# EAGLE design main (EAGLE 9.6.2)
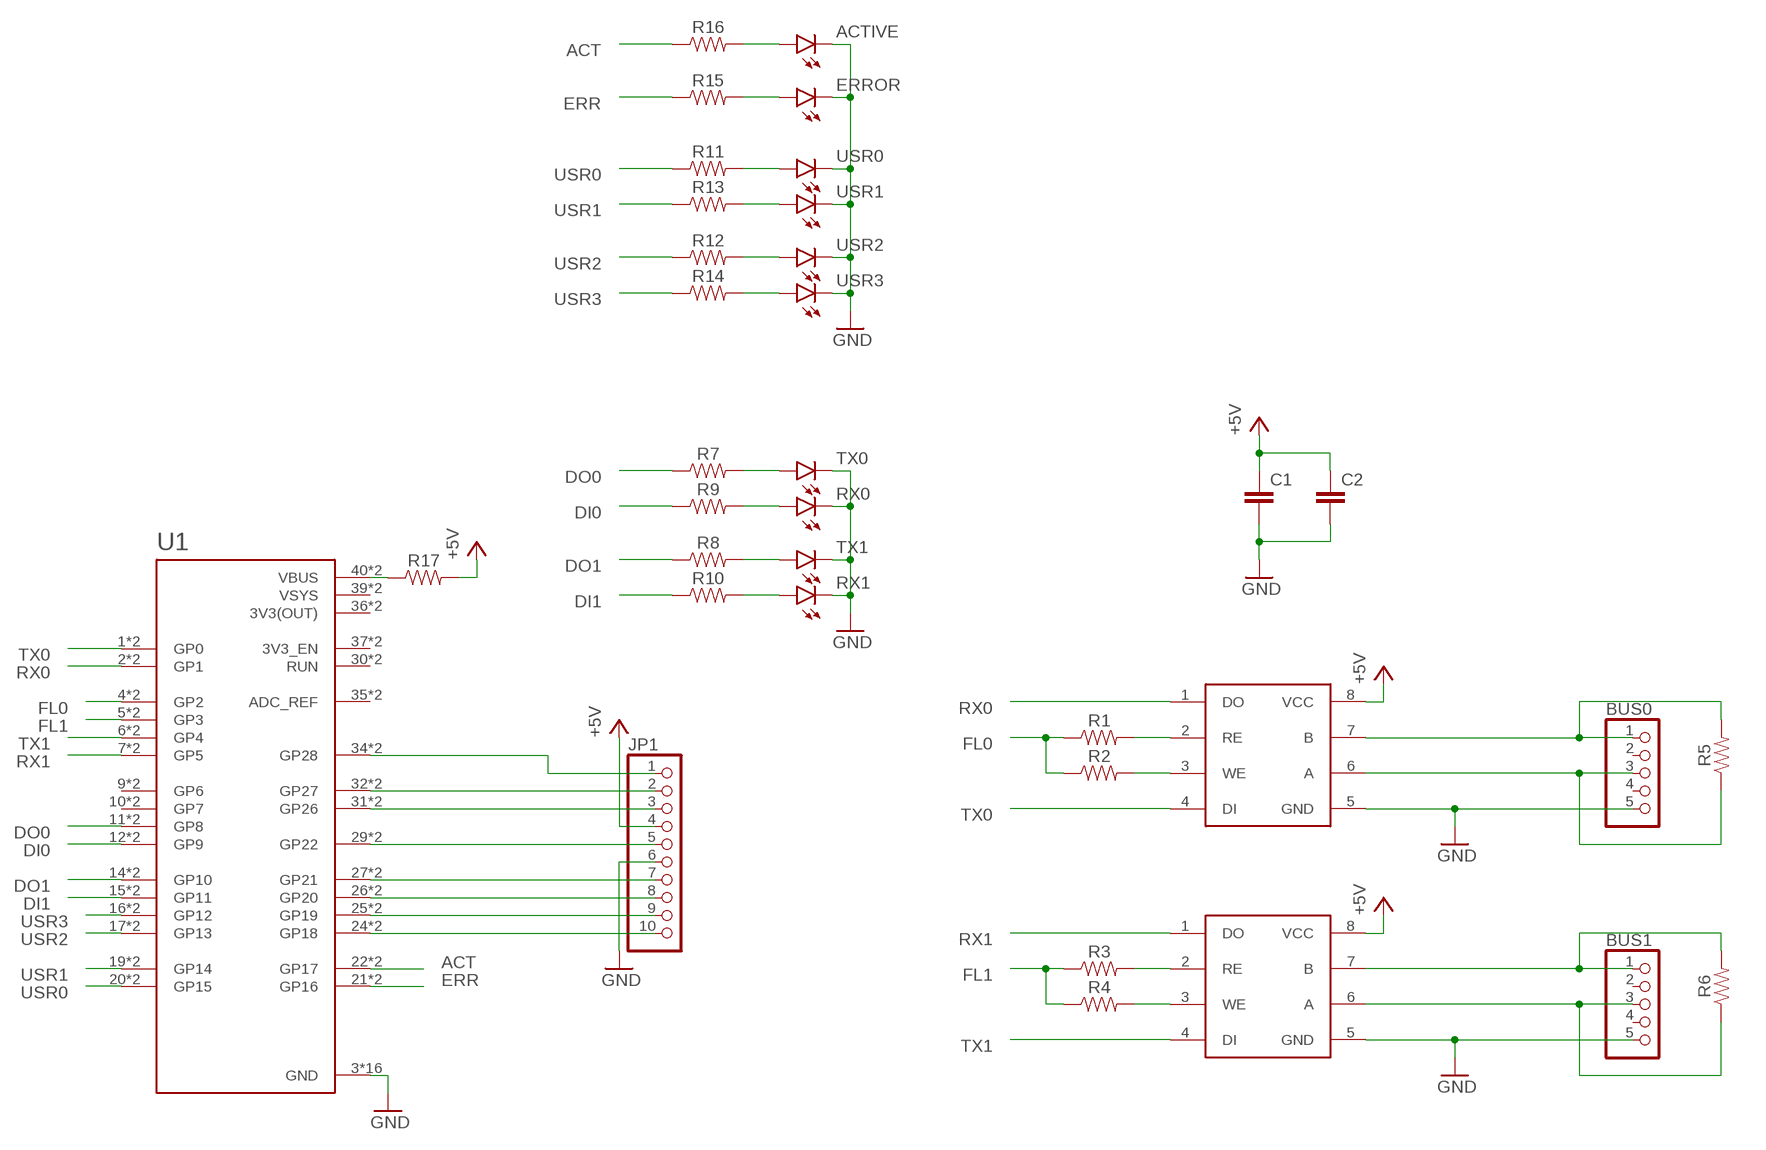
[diagram p0: schematic, sheet 1]

## Parts
ACTIVE  LED0603  [LED-0603]
BUS0  PINHD-1X5  [1X05]
BUS1  PINHD-1X5  [1X05]
C1  CAP-0603  [0603]
C2  CAP-0603  [0603]
ERROR  LED0603  [LED-0603]
JP1  PINHD-1X10  [1X10]
R1  RESISTOR0603  [0603]
R2  RESISTOR0603  [0603]
R3  RESISTOR0603  [0603]
R4  RESISTOR0603  [0603]
R5  RESISTOR0603  [0603]
R6  RESISTOR0603  [0603]
R7  RESISTOR0603  [0603]
R8  RESISTOR0603  [0603]
R9  RESISTOR0603  [0603]
R10  RESISTOR0603  [0603]
R11  RESISTOR0603  [0603]
R12  RESISTOR0603  [0603]
R13  RESISTOR0603  [0603]
R14  RESISTOR0603  [0603]
R15  RESISTOR0603  [0603]
R16  RESISTOR0603  [0603]
R17  RESISTOR0603  [0603]
RX0  LED0603  [LED-0603]
RX1  LED0603  [LED-0603]
TX0  LED0603  [LED-0603]
TX1  LED0603  [LED-0603]
U1  RASPBERRY_PICO-NO_DEBUG  [PICO-PKG-NO_DEBUG]
U$1  MAX485  [SO8]
U$2  MAX485  [SO8]
USR0  LED0603  [LED-0603]
USR1  LED0603  [LED-0603]
USR2  LED0603  [LED-0603]
USR3  LED0603  [LED-0603]

## Nets
+5V: C1.1 C2.1 JP1.4 R17.2 U$1.8(VCC) U$2.8(VCC)
ACT: R16.1 U1.22(GP17) U1.P$22(GP17)
DI0: R9.1 U1.12(GP9) U1.P$12(GP9)
DI1: R10.1 U1.15(GP11) U1.P$15(GP11)
DO0: R7.1 U1.11(GP8) U1.P$11(GP8)
DO1: R8.1 U1.14(GP10) U1.P$14(GP10)
ERR: R15.1 U1.21(GP16) U1.P$21(GP16)
FL0: R1.1 R2.1 U1.4(GP2) U1.P$4(GP2)
FL1: R3.1 R4.1 U1.5(GP3) U1.P$5(GP3)
GND: ACTIVE.C BUS0.5 BUS1.5 C1.2 C2.2 ERROR.C JP1.6 RX0.C RX1.C TX0.C TX1.C U1.3(GND) U1.8(GND) U1.13(GND) U1.18(GND) U1.23(GND) U1.28(GND) U1.33(GND) U1.38(GND) U1.P$3(GND) U1.P$8(GND) U1.P$13(GND) U1.P$18(GND) U1.P$23(GND) U1.P$28(GND) U1.P$33(GND) U1.P$38(GND) U$1.5(GND) U$2.5(GND) USR0.C USR1.C USR2.C USR3.C
N$1: BUS0.1 R5.2 U$1.7(B)
N$2: BUS0.3 R5.1 U$1.6(A)
N$3: BUS1.1 R6.2 U$2.7(B)
N$4: BUS1.3 R6.1 U$2.6(A)
N$5: R1.2 U$1.2(RE)
N$6: R2.2 U$1.3(WE)
N$7: R3.2 U$2.2(RE)
N$8: R4.2 U$2.3(WE)
N$9: R11.2 USR0.A
N$10: R7.2 TX0.A
N$11: R9.2 RX0.A
N$12: R8.2 TX1.A
N$13: R10.2 RX1.A
N$14: R13.2 USR1.A
N$15: R12.2 USR2.A
N$16: R14.2 USR3.A
N$17: ERROR.A R15.2
N$18: ACTIVE.A R16.2
N$19: JP1.10 U1.24(GP18) U1.P$24(GP18)
N$20: JP1.9 U1.25(GP19) U1.P$25(GP19)
N$21: JP1.8 U1.26(GP20) U1.P$26(GP20)
N$22: JP1.7 U1.27(GP21) U1.P$27(GP21)
N$23: JP1.5 U1.29(GP22) U1.P$29(GP22)
N$24: JP1.3 U1.31(GP26) U1.P$31(GP26)
N$25: JP1.2 U1.32(GP27) U1.P$32(GP27)
N$26: JP1.1 U1.34(GP28) U1.P$34(GP28)
N$27: R17.1 U1.40(VBUS) U1.P$40(VBUS)
RX0: U1.2(GP1) U1.P$2(GP1) U$1.1(DO)
RX1: U1.7(GP5) U1.P$7(GP5) U$2.1(DO)
TX0: U1.1(GP0) U1.P$1(GP0) U$1.4(DI)
TX1: U1.6(GP4) U1.P$6(GP4) U$2.4(DI)
USR0: R11.1 U1.20(GP15) U1.P$20(GP15)
USR1: R13.1 U1.19(GP14) U1.P$19(GP14)
USR2: R12.1 U1.17(GP13) U1.P$17(GP13)
USR3: R14.1 U1.16(GP12) U1.P$16(GP12)
Unconnected: BUS0.2 BUS0.4 BUS1.2 BUS1.4 U1.9(GP6) U1.10(GP7) U1.30(RUN) U1.35(ADC_REF) U1.37(3V3_EN) U1.P$9(GP6) U1.P$10(GP7) U1.P$30(RUN) U1.P$35(ADC_REF) U1.P$37(3V3_EN)

## Power pins joined to a net without a drawn wire
3V3(OUT): U1.36(3V3(OUT)) U1.P$36(3V3(OUT))
VSYS: U1.39(VSYS) U1.P$39(VSYS)

## Library data of the parts
ACTIVE ERROR RX0 RX1 TX0 TX1 USR0 USR1-USR3 = SparkFun-LED:LED: LED (Generic) Standard schematic elements and footprints for 5mm, 3mm, 1206, and 0603 sized LEDs. Generic LEDs with no color specified.
BUS0 BUS1 = pinhead:PINHD-1X5: PIN HEADER
C1 C2 = SparkFun-Capacitors:CAP
JP1 = pinhead:PINHD-1X10: PIN HEADER
R1-R17 = SparkFun-Resistors:RESISTOR: Generic Resistor Package
U1 = RpiPico:RASPBERRY_PICO-NO_DEBUG
U$1 U$2 = Max485:MAX485

## Board
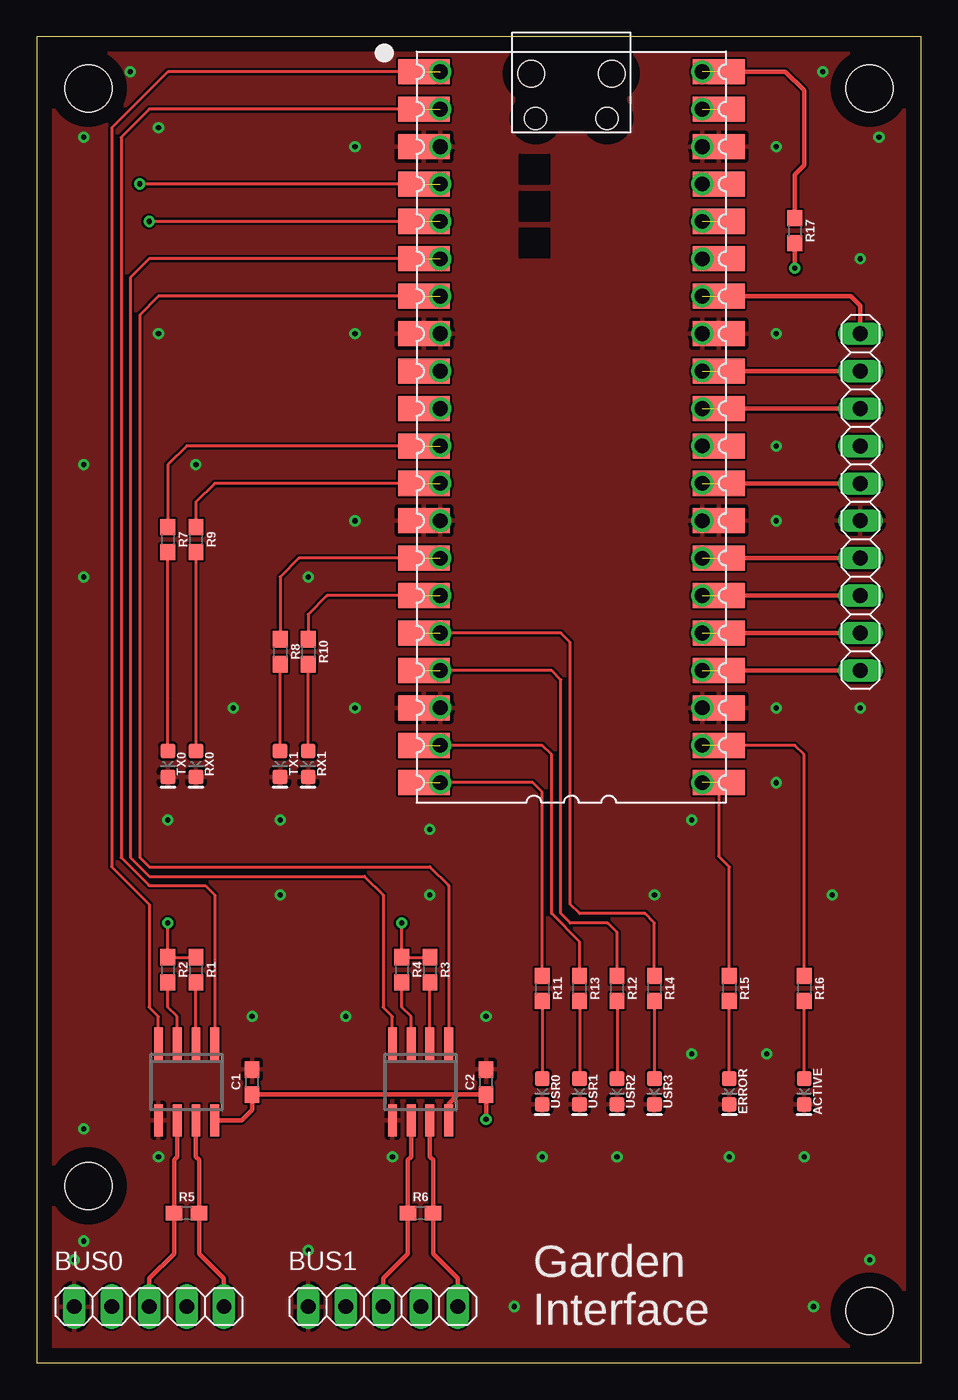
[diagram p1: board, top side]
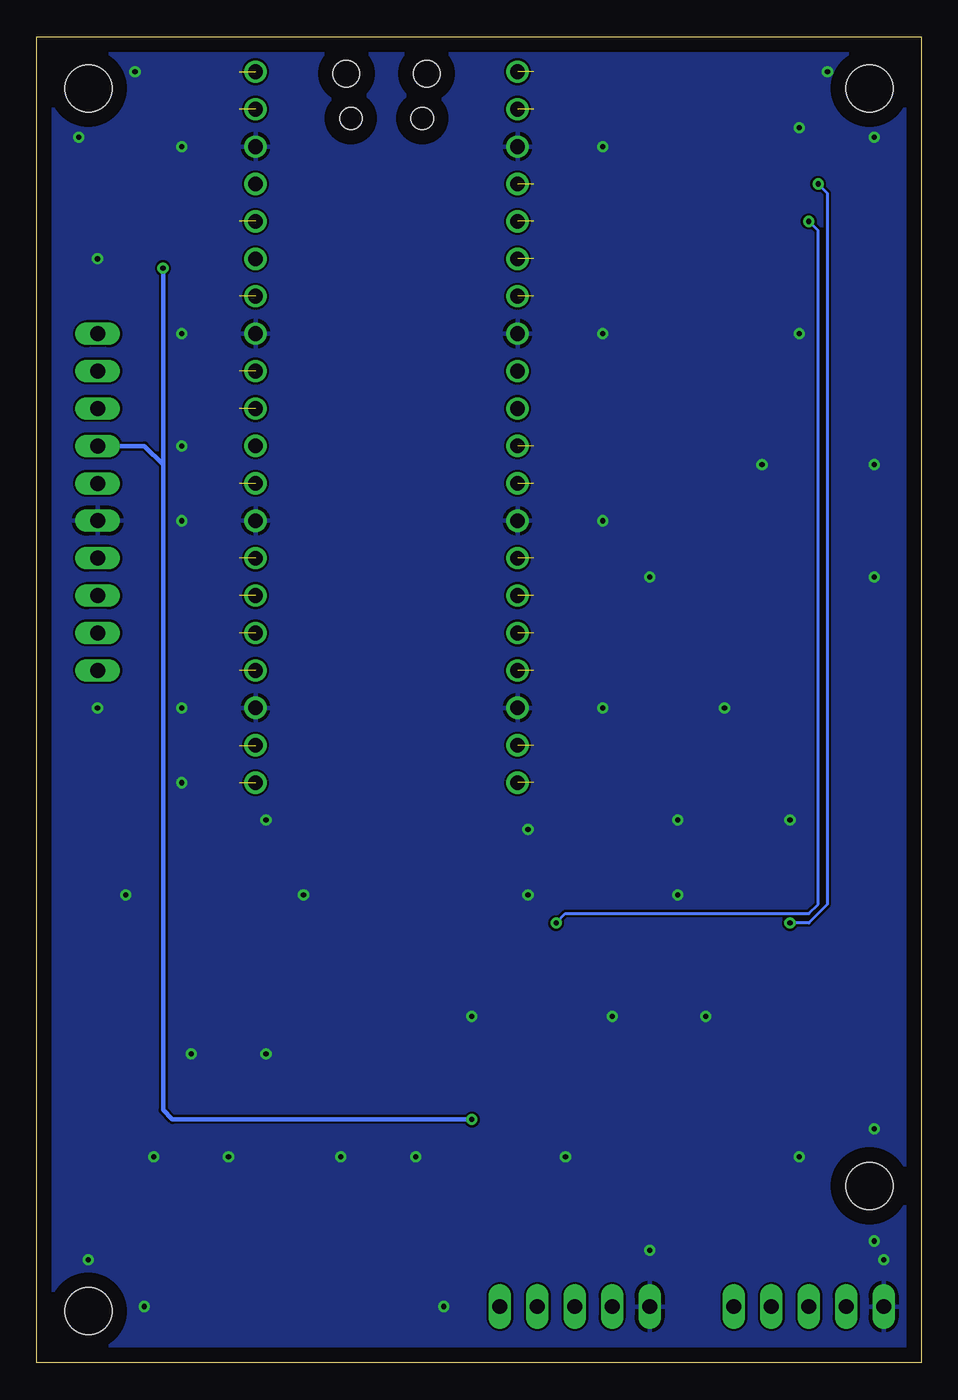
[diagram p2: board, bottom side, seen from below]

Size 60 x 90 mm. Coordinates in mm from the lower left corner, seen from the top.
Outline: 0,0 60,0 60,90 0,90 0,0
Copper layers (1*16): Top 0.035mm / dielectric 1.5mm / Bottom 0.035mm
Design rules "default": minimum track width 6mil, minimum drill 0.35mm, track to track 6mil, track to pad 6mil, pad to pad 6mil, via to via 6mil, smd to smd 6mil, copper to edge 40mil, drill to drill 6mil, minimum pad ring 10mil, minimum via ring 8mil, stop-mask expansion 4mil, vias tented up to drill 0mil, thermal gap 10mil
Holes 3.2 mm at 3.5,86.5 56.5,86.5 56.5,3.5 3.5,12

### Footprints (pad centres in the part's own frame; a part is rotated, then mirrored left to right if it is on the bottom)
LED-0603 = smd 1 x 1: A -0.877,0; C 0.877,0
1X05 = drill 1.016 long: 1 -5.08,0; 2 -2.54,0; 3 0,0; 4 2.54,0; 5 5.08,0
0603 = smd 1.1 x 1: 1 -0.85,0; 2 0.85,0
1X10 = drill 1.016 long: 1 -11.43,0; 2 -8.89,0; 3 -6.35,0; 4 -3.81,0; 5 -1.27,0; 6 1.27,0; 7 3.81,0; 8 6.35,0; 9 8.89,0; 10 11.43,0
PICO-PKG-NO_DEBUG = drill 1: 1 -7.62,25.4; 2 -7.62,22.86; 3 -7.62,20.32; 4 -7.62,17.78; 5 -7.62,15.24; 6 -7.62,12.7; 7 -7.62,10.16; 8 -7.62,7.62; 9 -7.62,5.08; 10 -7.62,2.54; 11 -7.62,0; 12 -7.62,-2.54; 13 -7.62,-5.08; 14 -7.62,-7.62; 15 -7.62,-10.16; 16 -7.62,-12.7; 17 -7.62,-15.24; 18 -7.62,-17.78; 19 -7.62,-20.32; 20 -7.62,-22.86; 21 10.16,-22.86; 22 10.16,-20.32; 23 10.16,-17.78; 24 10.16,-15.24; 25 10.16,-12.7; 26 10.16,-10.16; 27 10.16,-7.62; 28 10.16,-5.08; 29 10.16,-2.54; 30 10.16,0; 31 10.16,2.54; 32 10.16,5.08; 33 10.16,7.62; 34 10.16,10.16; 35 10.16,12.7; 36 10.16,15.24; 37 10.16,17.78; 38 10.16,20.32; 39 10.16,22.86; 40 10.16,25.4 | smd 3.5 x 1.7: P$1 -8.73,25.4; P$2 -8.73,22.86; P$3 -8.73,20.32; P$4 -8.73,17.78; P$5 -8.73,15.24; P$6 -8.73,12.7; P$7 -8.73,10.16; P$8 -8.73,7.62; P$9 -8.73,5.08; P$10 -8.73,2.54; P$11 -8.73,0; P$12 -8.73,-2.54; P$13 -8.73,-5.08; P$14 -8.73,-7.62; P$15 -8.73,-10.16; P$16 -8.73,-12.7; P$17 -8.73,-15.24; P$18 -8.73,-17.78; P$19 -8.73,-20.32; P$20 -8.73,-22.86; P$21 11.27,-22.86; P$22 11.27,-20.32; P$23 11.27,-17.78; P$24 11.27,-15.24; P$25 11.27,-12.7; P$26 11.27,-10.16; P$27 11.27,-7.62; P$28 11.27,-5.08; P$29 11.27,-2.54; P$30 11.27,0; P$31 11.27,2.54; P$32 11.27,5.08; P$33 11.27,7.62; P$34 11.27,10.16; P$35 11.27,12.7; P$36 11.27,15.24; P$37 11.27,17.78; P$38 11.27,20.32; P$39 11.27,22.86; P$40 11.27,25.4 | hole 1.8: -1.455,25.27; 3.995,25.27 | hole 1.5: -1.155,22.24; 3.695,22.24
SO8 = smd 0.6 x 2.2: 1 -1.905,-2.6; 2 -0.635,-2.6; 3 0.635,-2.6; 4 1.905,-2.6; 5 1.905,2.6; 6 0.635,2.6; 7 -0.635,2.6; 8 -1.905,2.6

### Placement (x,y rotation side)
ACTIVE  52.07,18.41 270 top
BUS0  7.62,3.81 180 top
BUS1  23.5,3.81 180 top
C1  14.61,19.05 90 top
C2  30.48,19.05 90 top
ERROR  46.99,18.41 270 top
JP1  55.88,58.42 270 top
R1  10.79,26.67 270 top
R2  8.89,26.67 270 top
R3  26.67,26.67 270 top
R4  24.77,26.67 270 top
R5  10.16,10.16 0 top
R6  26.04,10.16 0 top
R7  8.89,55.88 270 top
R8  16.51,48.26 270 top
R9  10.79,55.88 270 top
R10  18.41,48.26 270 top
R11  34.29,25.4 270 top
R12  39.37,25.4 270 top
R13  36.83,25.4 270 top
R14  41.91,25.4 270 top
R15  46.99,25.4 270 top
R16  52.07,25.4 270 top
R17  51.44,76.83 270 top
RX0  10.79,40.64 270 top
RX1  18.41,40.64 270 top
TX0  8.89,40.64 270 top
TX1  16.51,40.64 270 top
U1  35,62.23 0 top
U$1  10.16,19.05 180 top
U$2  26.04,19.05 180 top
USR0  34.29,18.41 270 top
USR1  36.83,18.41 270 top
USR2  39.37,18.41 270 top
USR3  41.91,18.41 270 top

### Tracks (layer width: path | path; a pad name or v marks a point on that pad's centre or on a via)
3V3(OUT)  (1 unrouted)
+5V  (via drill 0.35)
  Top 0.305: U$1.8 13.91,16.45 14.61,17.14 C1.1 28.57,18.2 | 28.57,18.2 C2.1 v30.48,16.51 | U$2.8 27.94,17.57 28.57,18.2 | R17.2 v51.44,74.3
  Bottom 0.305: JP1.4 52.7,62.23 51.44,60.96 | 51.44,60.96 51.44,17.14 50.8,16.51 v30.48,16.51 | v51.44,74.3 51.44,60.96
ACT  (1 unrouted)
  Top 0.203: R16.1 52.07,41.27 51.44,41.91 U1.P$22
DI0  (1 unrouted)
  Top 0.203: U1.P$12 12.06,59.69 10.79,58.42 R9.1
DI1  (1 unrouted)
  Top 0.203: U1.P$15 19.68,52.07 18.41,50.8 R10.1
DO0  (1 unrouted)
  Top 0.203: U1.P$11 10.16,62.23 8.89,60.96 R7.1
DO1  (1 unrouted)
  Top 0.203: U1.P$14 17.78,54.61 16.51,53.34 R8.1
ERR  (1 unrouted)
  Top 0.203: U1.P$21 46.27,34.38 46.99,33.66 R15.1
FL0  (via drill 0.35)  (1 unrouted)
  Top 0.203: R1.1 R2.1 v8.89,29.84 | U1.P$4 v6.99,80.01
  Bottom 0.203: v6.99,80.01 6.35,79.38 6.35,31.11 7.62,29.84 v8.89,29.84
FL1  (via drill 0.35)  (1 unrouted)
  Top 0.203: R3.1 R4.1 v24.77,29.84 | v7.62,77.47 U1.P$5
  Bottom 0.203: v7.62,77.47 6.99,76.83 6.99,31.11 7.62,30.48 24.13,30.48 v24.77,29.84
GND  (via drill 0.35)
  other vias: 3.17,83.19 6.35,87.63 53.34,87.63 57.15,83.19 56.52,6.99 52.7,3.81 3.17,15.88 3.17,8.26 2.54,6.99 8.26,13.97 24.13,13.97 30.48,23.5 14.61,23.5 26.67,31.75 8.89,36.83 16.51,36.83 10.79,60.96 18.41,53.34 8.26,83.82 3.17,60.96 3.17,53.34 26.67,36.2 44.45,36.83 55.88,44.45 55.88,74.93 34.29,13.97 39.37,13.97 46.99,13.97 52.07,13.97 44.45,20.95 41.91,31.75 49.53,20.95 18.41,7.62 20.95,23.5 16.51,31.75 21.59,69.85 21.59,82.55 21.59,57.15 21.59,44.45 50.16,69.85 50.16,62.23 50.16,57.15 50.16,44.45 50.16,39.37 53.98,31.75 32.38,3.81 50.16,82.55 8.26,69.85 13.34,44.45
  pour Top: -0.64,90.81 60.96,90.81 60.96,-0.64 22.23,-0.64 -0.64,-0.64
  pour Bottom: -1.27,91.44 61.59,91.44 61.59,-1.27 -1.27,-1.27
N$1
  Top 0.305: U$1.7 10.79,13.97 11.01,13.76 R5.2 11.01,7.41 12.7,5.71 BUS0.1
N$2
  Top 0.305: U$1.6 9.53,13.97 9.31,13.76 R5.1 9.31,7.41 7.62,5.71 BUS0.3
N$3
  Top 0.305: U$2.7 26.67,13.97 26.89,13.76 R6.2 26.89,7.41 28.57,5.71 BUS1.1
N$4
  Top 0.305: U$2.6 25.4,13.97 25.18,13.76 R6.1 25.18,7.41 23.5,5.71 BUS1.3
N$5
  Top 0.203: U$1.2 R1.2
N$6
  Top 0.203: U$1.3 9.53,23.5 8.89,24.13 R2.2
N$7
  Top 0.203: U$2.2 R3.2
N$8
  Top 0.203: U$2.3 25.4,23.5 24.77,24.13 R4.2
N$9
  Top 0.203: R11.2 USR0.A
N$10
  Top 0.203: TX0.A 8.89,45.09 | 8.89,45.09 R7.2 | 8.89,45.09
N$11
  Top 0.203: R9.2 RX0.A
N$12
  Top 0.203: TX1.A R8.2
N$13
  Top 0.203: RX1.A R10.2
N$14
  Top 0.203: R13.2 USR1.A
N$15
  Top 0.203: R12.2 USR2.A
N$16
  Top 0.203: R14.2 USR3.A
N$17
  Top 0.203: ERROR.A R15.2
N$18
  Top 0.203: ACTIVE.A R16.2
N$19  (1 unrouted)
  Top 0.305: U1.P$24 JP1.10
N$20  (1 unrouted)
  Top 0.305: U1.P$25 JP1.9
N$21  (1 unrouted)
  Top 0.305: U1.P$26 JP1.8
N$22  (1 unrouted)
  Top 0.305: U1.P$27 JP1.7
N$23  (1 unrouted)
  Top 0.305: U1.P$29 JP1.5
N$24  (1 unrouted)
  Top 0.305: U1.P$31 JP1.3
N$25  (1 unrouted)
  Top 0.305: U1.P$32 JP1.2
N$26  (1 unrouted)
  Top 0.305: U1.P$34 55.24,72.39 55.88,71.75 JP1.1
N$27  (1 unrouted)
  Top 0.305: U1.P$40 50.8,87.63 52.07,86.36 52.07,81.28 51.44,80.64 R17.1
RX0  (1 unrouted)
  Top 0.203: U$1.1 12.06,31.75 11.43,32.38 7.62,32.38 5.71,34.29 5.71,83.19 7.62,85.09 U1.P$2
RX1  (1 unrouted)
  Top 0.203: U$2.1 27.94,32.38 26.67,33.66 7.62,33.66 6.99,34.29 6.99,71.12 8.26,72.39 U1.P$7
TX0  (1 unrouted)
  Top 0.203: U$1.4 8.26,23.5 7.62,24.13 7.62,31.11 5.08,33.66 5.08,83.82 8.89,87.63 U1.P$1
TX1  (1 unrouted)
  Top 0.203: U$2.4 24.13,23.5 23.5,24.13 23.5,31.75 22.23,33.02 7.62,33.02 6.35,34.29 6.35,73.66 7.62,74.93 U1.P$6
USR0  (1 unrouted)
  Top 0.203: R11.1 34.29,38.73 33.66,39.37 U1.P$20
USR1  (1 unrouted)
  Top 0.203: R13.1 36.83,28.57 34.92,30.48 34.92,41.27 34.29,41.91 U1.P$19
USR2  (1 unrouted)
  Top 0.203: R12.1 39.37,29.21 38.73,29.84 36.2,29.84 35.56,30.48 35.56,46.35 34.92,46.99 U1.P$17
USR3  (1 unrouted)
  Top 0.203: R14.1 41.91,29.84 41.27,30.48 36.83,30.48 36.2,31.11 36.2,48.9 35.56,49.53 U1.P$16
VSYS  (1 unrouted)

### Text on the board
tNames: Garden / Interface